# EAGLE schematic FLC100_level_shifting_mag (EAGLE 6.4)
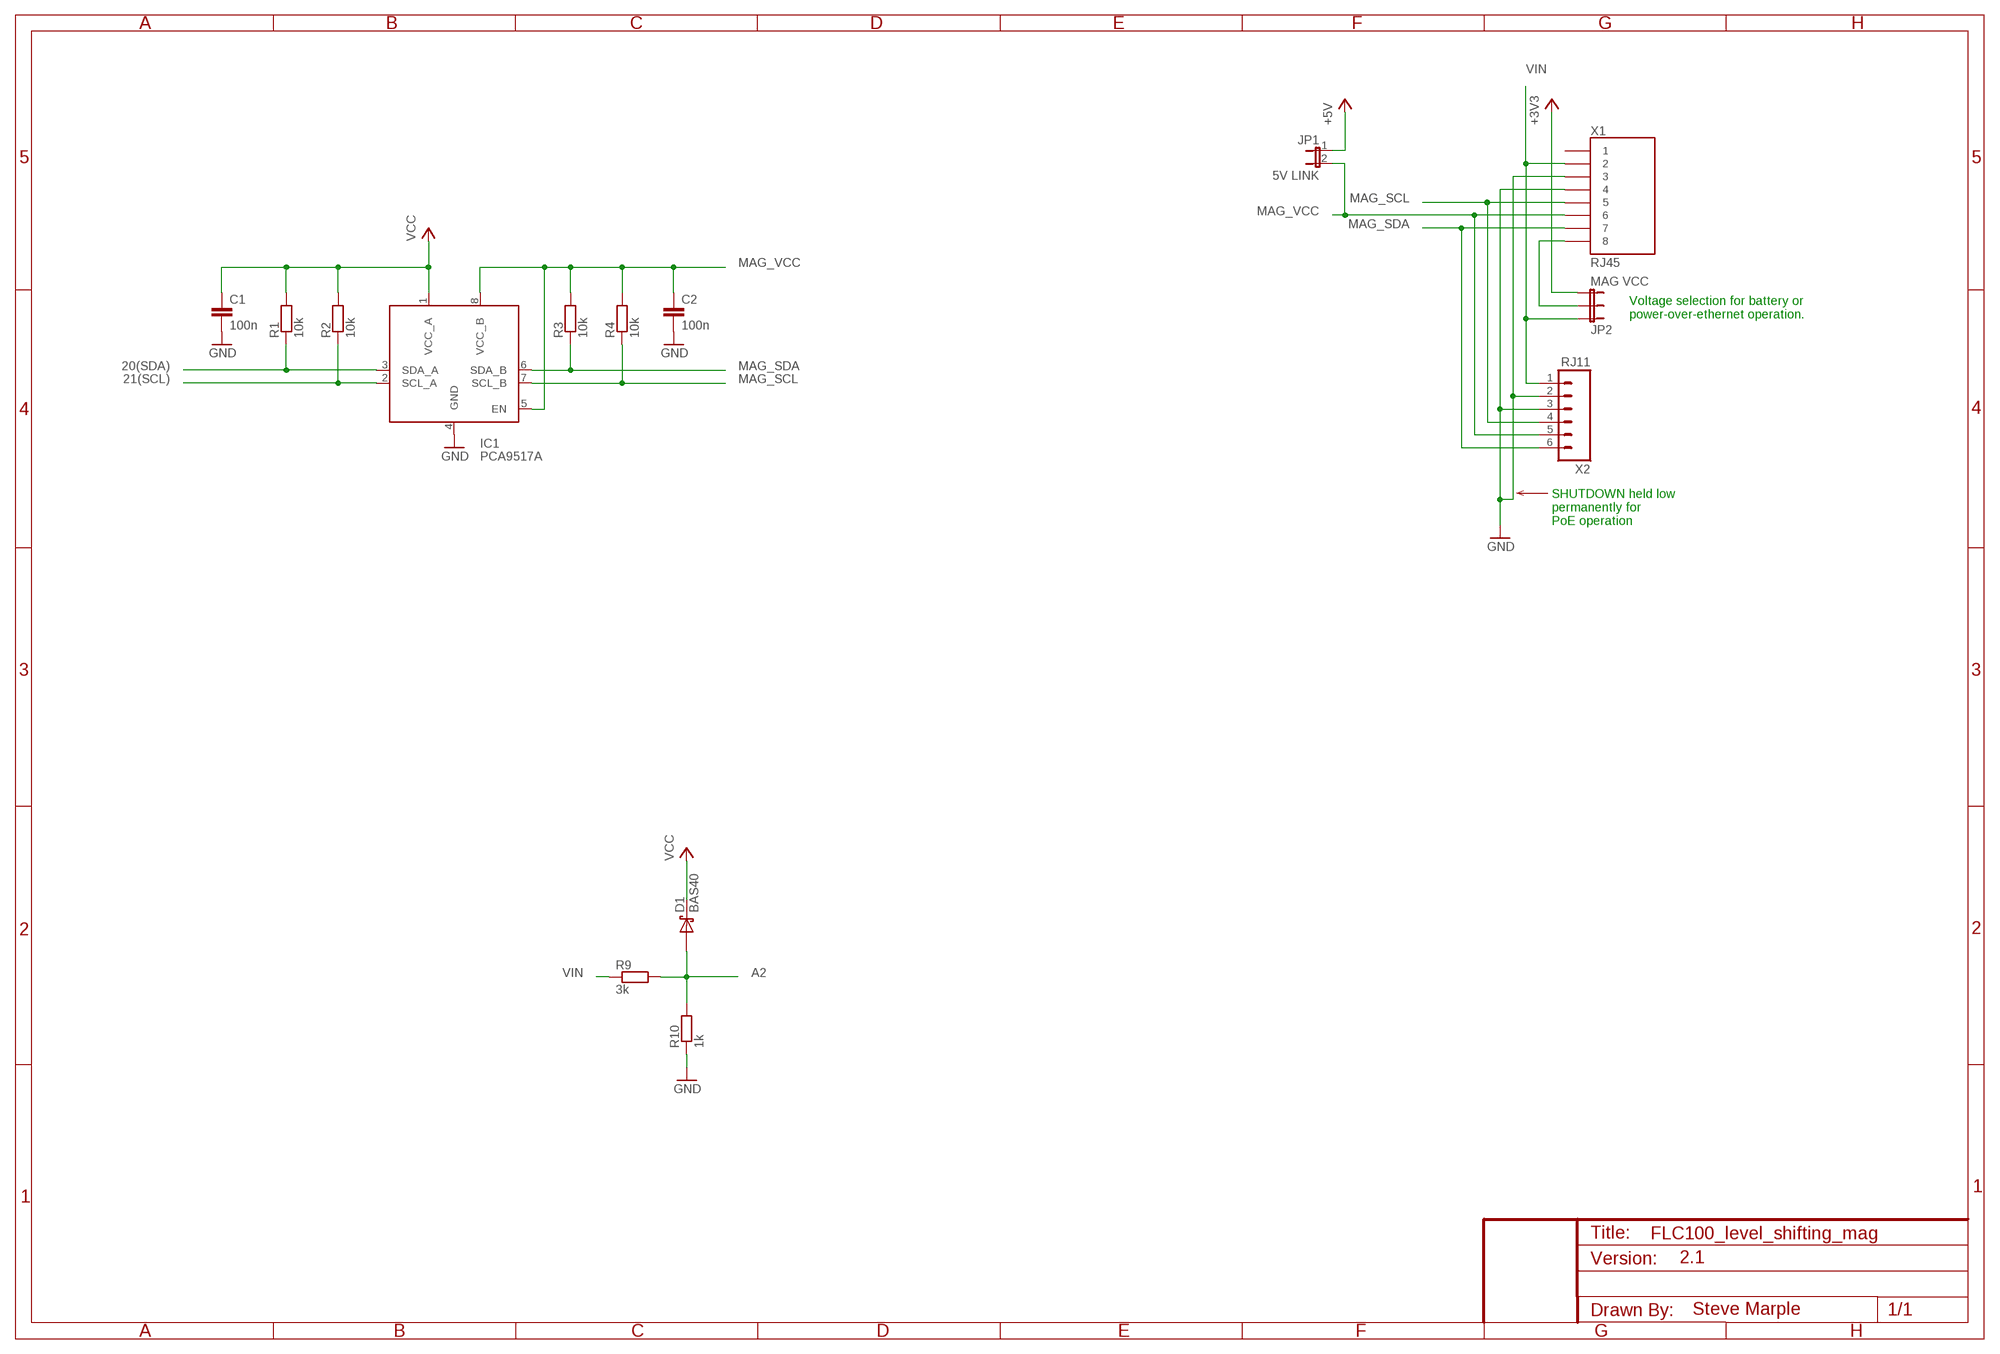
[diagram p0: schematic, sheet 1]

## Parts
C1  100n  C-EU1206-HAND  [1206-HAND]
C2  100n  C-EU1206-HAND  [1206-HAND]
D1  BAS40  DIODE-SCHOTTKYSOT23-1-3-HAND  [SOT23-3-HAND]
IC1  PCA9517A  PCA9517ASOIC  [SO08]
JP1  5V LINK  JUMPER-2PTH  [1X02]
JP2  MAG VCC  JUMPER-3PTH  [1X03]
R1  10k  RESISTOR1206-HAND  [1206-HAND]
R2  10k  RESISTOR1206-HAND  [1206-HAND]
R3  10k  RESISTOR1206-HAND  [1206-HAND]
R4  10k  RESISTOR1206-HAND  [1206-HAND]
R9  3k  RESISTOR1206-HAND  [1206-HAND]
R10  1k  RESISTOR1206-HAND  [1206-HAND]
X1  RJ45  RJ45-8PTH  [RJ45-8]
X2  RJ11  RJ11-6PTH  [RJ11-6]

## Nets
20(SDA): IC1.3(SDA_A) R1.1
21(SCL): IC1.2(SCL_A) R2.1
+3V3 [power]: JP2.3
+5V [power]: JP1.1
A2 [power]: D1.1(A) R9.2 R10.2
GND [power]: C1.2 C2.2 IC1.4(GND) R10.1 X1.3 X1.4 X2.2 X2.3
MAG_SCL: IC1.7(SCL_B) R4.1 X1.5 X2.4
MAG_SDA: IC1.6(SDA_B) R3.1 X1.7 X2.6
MAG_VCC: C2.1 IC1.5(EN) IC1.8(VCC_B) JP1.2 R3.2 R4.2 X1.6 X2.5
N$7 [power]: JP2.2 X1.8
VCC [power]: C1.1 D1.3(C) IC1.1(VCC_A) R1.2 R2.2
VIN [power]: JP2.1 R9.1 X1.2 X2.1
Unconnected: X1.1

## Notes on the sheet
- Voltage selection for battery or
  power-over-ethernet operation.
- SHUTDOWN held low
  permanently for 
  PoE operation
- 2.1
- Steve Marple

## Library data of the parts
C1 C2 = SteveMarple:C-EU
D1 = SteveMarple:DIODE-SCHOTTKY
IC1 = SteveMarple:PCA9517A
JP1 = SparkFun:JUMPER-2: Jumper Basic 0.1" spaced jumper. Use with breakaway headers.
JP2 = SparkFun:JUMPER-3
R1-R4 R9 R10 = SteveMarple:RESISTOR: 1/4W PTH resistor
X1 = SteveMarple:RJ45-8: RJ45 Jack Simple RJ45, 8-pin connection - connector for common Cat5, Cat5e, and Cat6 Ethernet cables. Footprint not yet proven in production. Connector sku is PRT-00643; Breakout PCB sku is BOB-00716.
X2 = SteveMarple:RJ11-6: RJ11 Jack Simple 6 pin RJ11 jack. Commonly found on CAT3 devices and Microchip programmers. SKU: PRT-00132

## Net classes
1 power: width 0.381 mm
2 antenna: width 0.381 mm